# EAGLE design vocal_6btns (EAGLE 9.6.2)
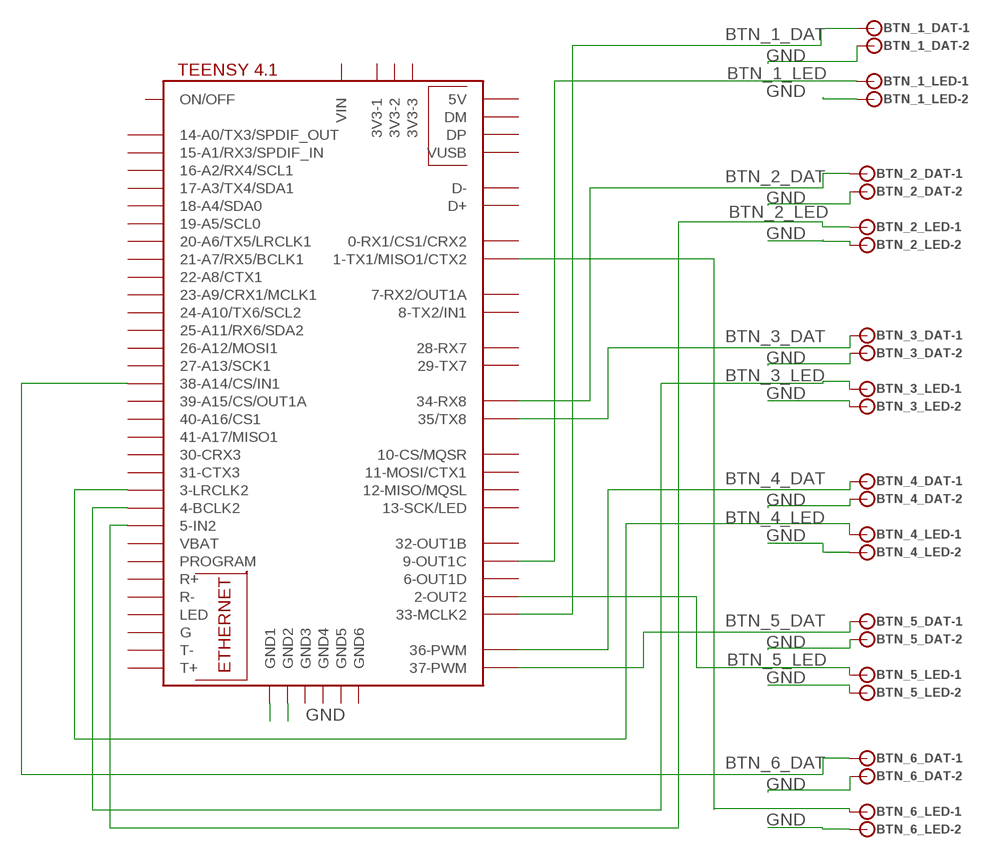
[diagram p0: schematic, sheet 1]

## Parts
BTN_1_DAT  JST-XH-2B  [B2B-XH-A]
BTN_1_LED  JST-XH-2B  [B2B-XH-A]
BTN_2_DAT  JST-XH-2B  [B2B-XH-A]
BTN_2_LED  JST-XH-2B  [B2B-XH-A]
BTN_3_DAT  JST-XH-2B  [B2B-XH-A]
BTN_3_LED  JST-XH-2B  [B2B-XH-A]
BTN_4_DAT  JST-XH-2B  [B2B-XH-A]
BTN_4_LED  JST-XH-2B  [B2B-XH-A]
BTN_5_DAT  JST-XH-2B  [B2B-XH-A]
BTN_5_LED  JST-XH-2B  [B2B-XH-A]
BTN_6_DAT  JST-XH-2B  [B2B-XH-A]
BTN_6_LED  JST-XH-2B  [B2B-XH-A]
U$1  TEENSY41  [TEENSY41]

## Nets
BTN_1_DAT: BTN_1_DAT.1 U$1.33-MCLK2
BTN_1_LED: BTN_1_LED.1 U$1.9-OUT1C
BTN_2_DAT: BTN_2_DAT.1 U$1.34-RX8
BTN_2_LED: BTN_2_LED.1 U$1.5-IN2
BTN_3_DAT: BTN_3_DAT.1 U$1.35-TX8(35/TX8)
BTN_3_LED: BTN_3_LED.1 U$1.4-BCLK2
BTN_4_DAT: BTN_4_DAT.1 U$1.36-PWM
BTN_4_LED: BTN_4_LED.1 U$1.3-LRCLK2
BTN_5_DAT: BTN_5_DAT.1 U$1.37-PWM
BTN_5_LED: BTN_5_LED.1 U$1.2-OUT2
BTN_6_DAT: BTN_6_DAT.1 U$1.38-A14/CS/IN1
GND: BTN_1_DAT.2 BTN_1_LED.2 BTN_2_DAT.2 BTN_2_LED.2 BTN_3_DAT.2 BTN_3_LED.2 BTN_4_DAT.2 BTN_4_LED.2 BTN_5_DAT.2 BTN_5_LED.2 BTN_6_DAT.2 BTN_6_LED.2 U$1.GND1 U$1.GND2
N$1: BTN_6_LED.1 U$1.1-TX1/MISO1/CTX2
Unconnected: U$1.0-RX1/CS1/CRX2 U$1.3V3-1 U$1.3V3-2 U$1.3V3-3 U$1.6-OUT1D U$1.7-RX2/OUT1A U$1.8-TX2/IN1 U$1.10-CS\MQSR(10-CS/MQSR) U$1.11-MOSI/CTX1 U$1.12-MISO/MQSL U$1.13-SCK/LED U$1.14-A0/TX3/SPDIF_OUT U$1.15-A1/RX3/SPDIF_IN U$1.16-A2/RX4/SCL1 U$1.17-A3/TX4/SDA1 U$1.18-A4/SDA0 U$1.19-A5/SCL0 U$1.20-A6/TX5/LRCLK1 U$1.21-A7/RX5/BCLK1 U$1.22-A8/CTX1 U$1.23-A9/CRX1/MCLK1 U$1.24-A10/TX6/SCL2 U$1.25-A11/RX6/SDA2 U$1.26-A12/MOSI1 U$1.27-A13/SCK1 U$1.28-RX7 U$1.29-TX7 U$1.30-CRX3 U$1.31-CTX3 U$1.32-OUT1B U$1.39-A15/CS/OUT1A U$1.40-A16/CS1 U$1.41-A17/MISO1 U$1.+5V(5V) U$1.D+ U$1.D- U$1.DM U$1.DP U$1.G U$1.GND3 U$1.GND4 U$1.GND5 U$1.GND6 U$1.LED U$1.ON/OFF U$1.PROGRAM U$1.R+ U$1.R- U$1.T+ U$1.T- U$1.VBAT U$1.VIN U$1.VUSB

## Library data of the parts
BTN_1_DAT BTN_1_LED BTN_2_DAT BTN_2_LED BTN_3_DAT BTN_3_LED BTN_4_DAT BTN_4_LED BTN_5_DAT BTN_5_LED BTN_6_DAT BTN_6_LED = con-JST-XH:JST-XH-2; MF: JST; MPN: B2B-XH-A
U$1 = teensy:TEENSY41

## Board
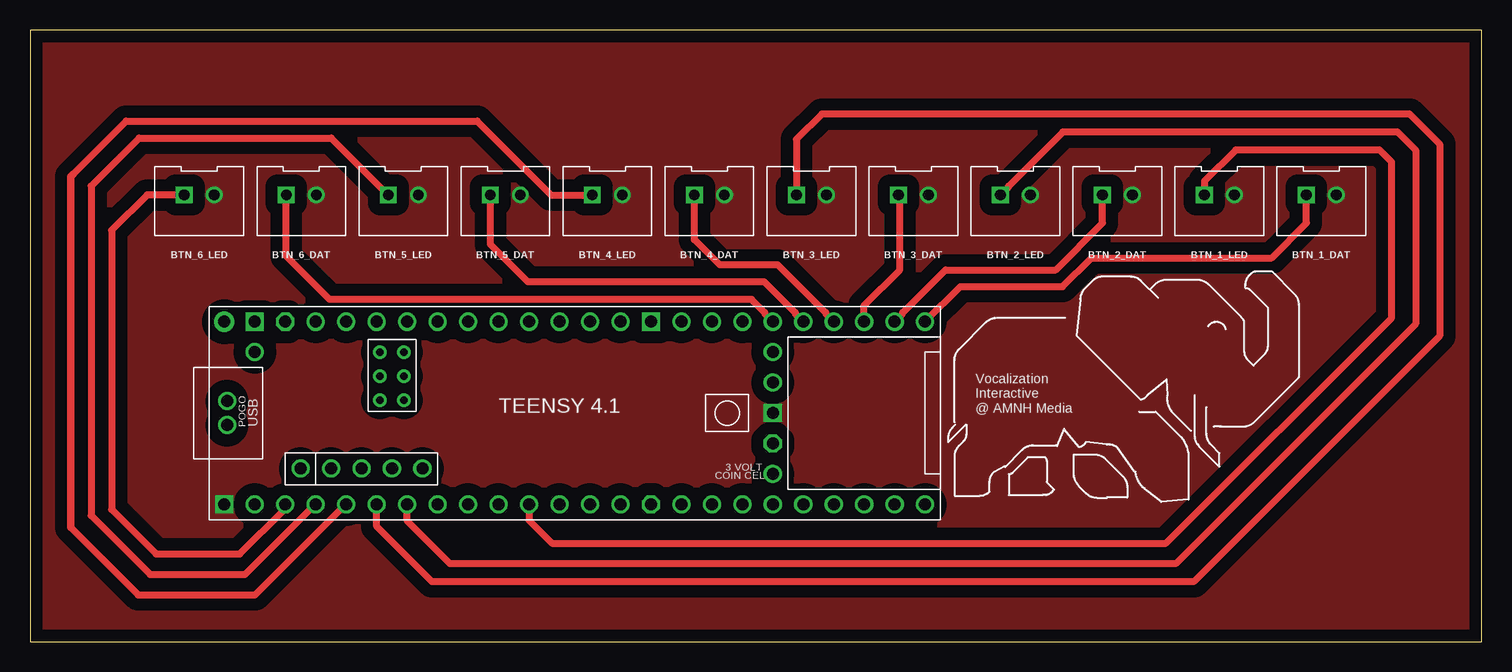
[diagram p1: board, top side]

Size 121 x 51 mm. Coordinates in mm from the lower left corner, seen from the top.
Outline: 0,0 121,0 121,51 0,51 0,0
Copper layers (1*16): Top 0.035mm / dielectric 1.5mm / Bottom 0.035mm
Design rules "default": minimum track width 16mil, minimum drill 0.8mm, track to track 0.8mm, track to pad 0.8mm, pad to pad 0.8mm, via to via 0.8mm, smd to smd 0mil, copper to edge 1mil, drill to drill 1mil, minimum pad ring 10mil, minimum via ring 10mil, stop-mask expansion 1mil, vias tented up to drill 30mil, thermal gap 10mil

### Footprints (pad centres in the part's own frame; a part is rotated, then mirrored left to right if it is on the bottom)
B2B-XH-A = drill 0.9 square: 1 1.25,0 | drill 0.9: 2 -1.25,0
TEENSY41 = drill 1: 0-RX1/CS1/CRX2 -27.94,-7.62; 1-TX1/MISO1/CTX2 -25.4,-7.62; 2-OUT2 -22.86,-7.62; 3-LRCLK2 -20.32,-7.62; 4-BCLK2 -17.78,-7.62; 5-IN2 -15.24,-7.62; 6-OUT1D -12.7,-7.62; 7-RX2/OUT1A -10.16,-7.62; 8-TX2/IN1 -7.62,-7.62; 9-OUT1C -5.08,-7.62; 10-CS\MQSR -2.54,-7.62; 11-MOSI/CTX1 0,-7.62; 12-MISO/MQSL 2.54,-7.62; 13-SCK/LED 2.54,7.62; 14-A0/TX3/SPDIF_OUT 0,7.62; 15-A1/RX3/SPDIF_IN -2.54,7.62; 16-A2/RX4/SCL1 -5.08,7.62; 17-A3/TX4/SDA1 -7.62,7.62; 18-A4/SDA0 -10.16,7.62; 19-A5/SCL0 -12.7,7.62; 20-A6/TX5/LRCLK1 -15.24,7.62; 21-A7/RX5/BCLK1 -17.78,7.62; 22-A8/CTX1 -20.32,7.62; 23-A9/CRX1/MCLK1 -22.86,7.62; 24-A10/TX6/SCL2 7.62,-7.62; 25-A11/RX6/SDA2 10.16,-7.62; 26-A12/MOSI1 12.7,-7.62; 27-A13/SCK1 15.24,-7.62; 28-RX7 17.78,-7.62; 29-TX7 20.32,-7.62; 30-CRX3 22.86,-7.62; 31-CTX3 25.4,-7.62; 32-OUT1B 27.94,-7.62; 33-MCLK2 27.94,7.62; 34-RX8 25.4,7.62; 35-TX8 22.86,7.62; 36-PWM 20.32,7.62; 37-PWM 17.78,7.62; 38-A14/CS/IN1 15.24,7.62; 39-A15/CS/OUT1A 12.7,7.62; 40-A16/CS1 10.16,7.62; 41-A17/MISO1 7.62,7.62; +5V -24.13,-4.62; D+ -30.25,-1; D- -30.25,1; DM -21.59,-4.62; DP -19.05,-4.62; GND4 -16.51,-4.62; GND5 -13.97,-4.62; ON/OFF 15.24,5.08; PROGRAM 15.24,2.54; VBAT 15.24,-5.08; VUSB -27.94,5.08 | drill 1 octagon: 3V3-1 5.08,-7.62; 3V3-2 15.24,-2.54; 3V3-3 -25.4,7.62 | drill 0.6: G -15.51,3.08; LED -17.51,3.08; R+ -17.51,5.08; R- -15.51,5.08; T+ -15.51,1.08; T- -17.51,1.08 | drill 1 square: GND1 -30.48,-7.62; GND2 15.24,0; GND3 5.08,7.62; GND6 -27.94,7.62 | drill 1 pad 1.676: VIN -30.48,7.62

### Placement (x,y rotation side)
BTN_1_DAT  107.65,37.25 180 top
BTN_1_LED  99.15,37.25 180 top
BTN_2_DAT  90.65,37.25 180 top
BTN_2_LED  82.14,37.25 180 top
BTN_3_DAT  73.64,37.25 180 top
BTN_3_LED  65.14,37.25 180 top
BTN_4_DAT  56.63,37.25 180 top
BTN_4_LED  48.13,37.25 180 top
BTN_5_DAT  39.63,37.25 180 top
BTN_5_LED  31.12,37.25 180 top
BTN_6_DAT  22.62,37.25 180 top
BTN_6_LED  14.12,37.25 180 top
U$1  46.68,19.05 0 top

### Tracks (layer width: path | path; a pad name or v marks a point on that pad's centre or on a via)
BTN_1_DAT
  Top 0.6: U$1.33-MCLK2 77.55,29.6 86.08,29.6 88.48,32 103.5,32 106.4,34.9 BTN_1_DAT.1
BTN_1_LED
  Top 0.6: U$1.9-OUT1C 41.6,10.11 43.5,8.21 94.71,8.21 113.5,27 113.5,40 112.5,41 100.5,41 97.9,38.4 BTN_1_LED.1
BTN_2_DAT
  Top 0.6: U$1.34-RX8 72.77,27.36 72.77,27.44 76.33,31 85.5,31 89.4,34.9 BTN_2_DAT.1
BTN_2_LED
  Top 0.6: U$1.5-IN2 31.44,10.06 35,6.5 95.5,6.5 115.5,26.5 115.5,41 114,42.5 86.09,42.5 81.59,38 81.59,37.95 BTN_2_LED.1
BTN_3_DAT
  Top 0.6: U$1.35-TX8 69.54,28.04 72.5,31 72.5,37.14 BTN_3_DAT.1
BTN_3_LED
  Top 0.6: U$1.4-BCLK2 28.9,9.6 33.5,5 97,5 117.5,25.5 117.5,41.5 115,44 66,44 63.89,41.89 BTN_3_LED.1
BTN_4_DAT
  Top 0.6: U$1.36-PWM 66.31,27.36 66.31,27.44 62.35,31.4 57.5,31.4 55.38,33.52 BTN_4_DAT.1
BTN_4_LED
  Top 0.6: 3.38,9.5 9,3.88 18.76,3.88 26.3,11.43 U$1.3-LRCLK2 | BTN_4_LED.1 43.43,37.25 37.28,43.4 8.01,43.4 3.61,39
  Top 0.61: 3.38,9.5 3.38,38.77 3.61,39
BTN_5_DAT
  Top 0.6: U$1.37-PWM 63.77,27.36 63.77,27.44 61.21,30 41.5,30 38.38,33.12 BTN_5_DAT.1
BTN_5_LED
  Top 0.6: U$1.2-OUT2 23.77,11.43 17.92,5.59 10,5.59 5.09,10.5 5.09,38 9.09,42 25.12,42 BTN_5_LED.1
BTN_6_DAT
  Top 0.6: U$1.38-A14/CS/IN1 61.23,27.36 61.23,27.44 60.15,28.52 24.98,28.52 21.37,32.13 BTN_6_DAT.1
GND
  pour Top (isolate 1.016, no thermals): 0,0 121,0 121,51 0,51
N$1
  Top 0.6: U$1.1-TX1/MISO1/CTX2 21.5,11.21 21.5,11 21.21,11 17.5,7.29 10.5,7.29 6.79,11 6.79,34.29 9.75,37.25 BTN_6_LED.1

### Text on the board
tNames: Vocalization / Interactive / @ AMNH Media